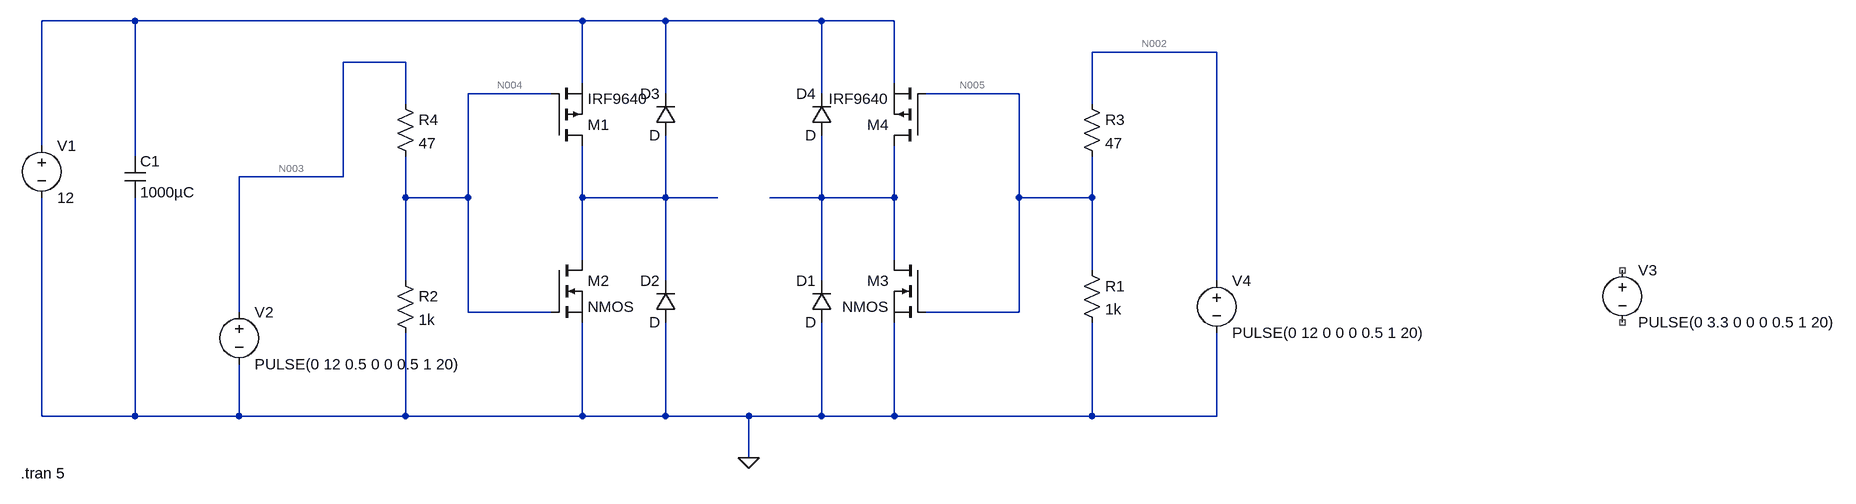
[diagram p0: schematic h-bridge.asc]
h-bridge.asc, the LTspice schematic file:
Version 4
SHEET 1 1932 680
WIRE -704 -1328 -848 -1328
WIRE -16 -1328 -704 -1328
WIRE 112 -1328 -16 -1328
WIRE 352 -1328 112 -1328
WIRE 464 -1328 352 -1328
WIRE 960 -1280 768 -1280
WIRE -288 -1264 -384 -1264
WIRE -16 -1232 -16 -1328
WIRE 464 -1232 464 -1328
WIRE -64 -1216 -192 -1216
WIRE 112 -1216 112 -1328
WIRE 352 -1216 352 -1328
WIRE 656 -1216 512 -1216
WIRE -288 -1200 -288 -1264
WIRE 768 -1200 768 -1280
WIRE -848 -1136 -848 -1328
WIRE -704 -1120 -704 -1328
WIRE -384 -1088 -384 -1264
WIRE -384 -1088 -544 -1088
WIRE -288 -1056 -288 -1120
WIRE -192 -1056 -192 -1216
WIRE -192 -1056 -288 -1056
WIRE -16 -1056 -16 -1136
WIRE 112 -1056 112 -1152
WIRE 112 -1056 -16 -1056
WIRE 192 -1056 112 -1056
WIRE 352 -1056 352 -1152
WIRE 352 -1056 272 -1056
WIRE 464 -1056 464 -1136
WIRE 464 -1056 352 -1056
WIRE 656 -1056 656 -1216
WIRE 768 -1056 768 -1120
WIRE 768 -1056 656 -1056
WIRE -16 -960 -16 -1056
WIRE 464 -960 464 -1056
WIRE 768 -944 768 -1056
WIRE -288 -928 -288 -1056
WIRE 112 -928 112 -1056
WIRE 352 -928 352 -1056
WIRE 960 -928 960 -1280
WIRE -544 -880 -544 -1088
WIRE -192 -880 -192 -1056
WIRE -64 -880 -192 -880
WIRE 656 -880 656 -1056
WIRE 656 -880 512 -880
WIRE -848 -720 -848 -1056
WIRE -704 -720 -704 -1056
WIRE -704 -720 -848 -720
WIRE -544 -720 -544 -800
WIRE -544 -720 -704 -720
WIRE -288 -720 -288 -848
WIRE -288 -720 -544 -720
WIRE -16 -720 -16 -864
WIRE -16 -720 -288 -720
WIRE 112 -720 112 -864
WIRE 112 -720 -16 -720
WIRE 240 -720 112 -720
WIRE 352 -720 352 -864
WIRE 352 -720 240 -720
WIRE 464 -720 464 -864
WIRE 464 -720 352 -720
WIRE 768 -720 768 -864
WIRE 768 -720 464 -720
WIRE 960 -720 960 -848
WIRE 960 -720 768 -720
WIRE 240 -656 240 -720
FLAG 240 -656 0
SYMBOL diode 368 -864 R180
WINDOW 0 24 64 Left 2
WINDOW 3 24 0 Left 2
SYMATTR InstName D1
SYMBOL diode 128 -864 R180
WINDOW 0 24 64 Left 2
WINDOW 3 24 0 Left 2
SYMATTR InstName D2
SYMBOL diode 128 -1152 R180
WINDOW 0 24 64 Left 2
WINDOW 3 24 0 Left 2
SYMATTR InstName D3
SYMBOL diode 368 -1152 R180
WINDOW 0 24 64 Left 2
WINDOW 3 24 0 Left 2
SYMATTR InstName D4
SYMBOL voltage -848 -1152 R0
WINDOW 123 0 0 Left 0
WINDOW 39 0 0 Left 0
SYMATTR InstName V1
SYMATTR Value 12
SYMBOL voltage -544 -896 R0
WINDOW 123 0 0 Left 0
WINDOW 39 0 0 Left 0
SYMATTR InstName V2
SYMATTR Value PULSE(0 12 0.5 0 0 0.5 1 20)
SYMBOL voltage 1584 -960 R0
WINDOW 123 0 0 Left 0
WINDOW 39 0 0 Left 0
SYMATTR InstName V3
SYMATTR Value PULSE(0 3.3 0 0 0 0.5 1 20)
SYMBOL nmos -64 -960 R0
SYMATTR InstName M2
SYMBOL nmos 512 -960 M0
SYMATTR InstName M3
SYMBOL res 752 -960 R0
SYMATTR InstName R1
SYMATTR Value 1k
SYMBOL res -304 -944 R0
SYMATTR InstName R2
SYMATTR Value 1k
SYMBOL pmos -64 -1136 M180
SYMATTR InstName M1
SYMATTR Value IRF9640
SYMBOL pmos 512 -1136 R180
SYMATTR InstName M4
SYMATTR Value IRF9640
SYMBOL res 752 -1216 R0
SYMATTR InstName R3
SYMATTR Value 47
SYMBOL res -304 -1216 R0
SYMATTR InstName R4
SYMATTR Value 47
SYMBOL cap -720 -1120 R0
SYMATTR InstName C1
SYMATTR Value 1000µC
SYMBOL voltage 960 -944 R0
WINDOW 123 0 0 Left 0
WINDOW 39 0 0 Left 0
SYMATTR InstName V4
SYMATTR Value PULSE(0 12 0 0 0 0.5 1 20)
TEXT -880 -632 Left 2 !.tran 5

The netlist it stands for:
* h-bridge.asc
D1 0 N007 D
D2 0 N006 D
D3 N006 N001 D
D4 N007 N001 D
V1 N001 0 12
V2 N003 0 PULSE(0 12 0.5 0 0 0.5 1 20)
V3 NC_01 NC_02 PULSE(0 3.3 0 0 0 0.5 1 20)
M2 N006 N004 0 0 NMOS
M3 N007 N005 0 0 NMOS
R1 N005 0 1k
R2 N004 0 1k
M1 N006 N004 N001 N001 IRF9640
M4 N007 N005 N001 N001 IRF9640
R3 N002 N005 47
R4 N003 N004 47
C1 N001 0 1000µC
V4 N002 0 PULSE(0 12 0 0 0 0.5 1 20)
.model D D
.lib standard.dio
.model NMOS NMOS
.model PMOS PMOS
.lib standard.mos
.tran 5
.backanno
.end

* Results of the author's LTspice run, read from the files saved beside the schematic
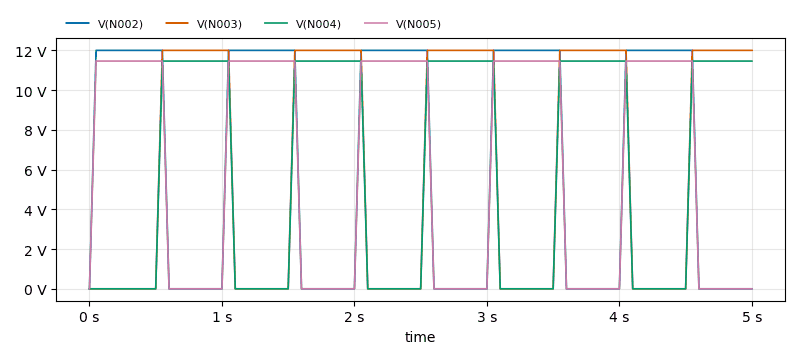
[diagram p1: Transient Analysis of h-bridge.asc, plotted from the saved traces]
* Transient Analysis, 1 run:
*   V(N002): min 0 V, max 12 V, average 6.6 V, rms 8.764 V, last 0 V
*   V(N003): min 0 V, max 12 V, average 6.42 V, rms 8.654 V, last 12 V
*   V(N004): min 0 V, max 11.46 V, average 6.132 V, rms 8.266 V, last 11.46 V
*   V(N005): min 0 V, max 11.46 V, average 6.304 V, rms 8.371 V, last 0 V